# Altium schematic sheet CS301_YOURGROUPNUM.SchDoc: G14 PCB
size A4; SheetNumber: 1; SheetTotal: 1
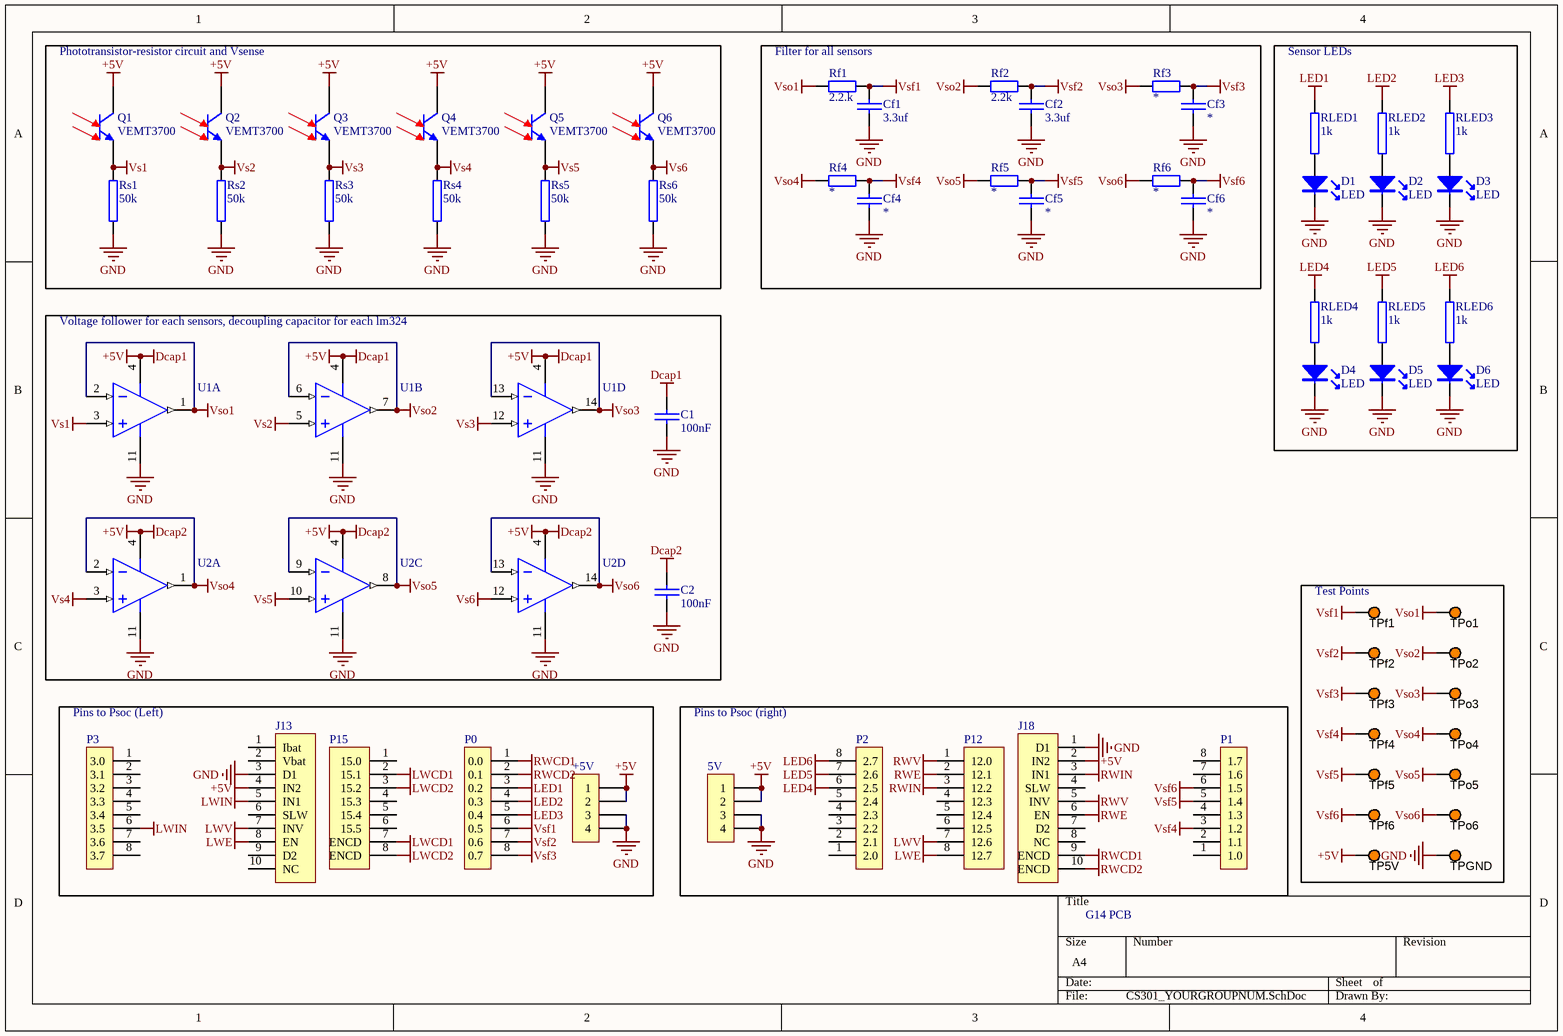
[diagram p0: CS301_YOURGROUPNUM.SchDoc]

## Parts
5V  5V  [IDC4]  (value not drawn)
+5V  5V  [IDC4]  (value not drawn)
C1  100nF  [CCAP-5P0]
C2  100nF  [CCAP-5P0]
Cf1  3.3uf  [CCAP-5P0]
Cf2  3.3uf  [CCAP-5P0]
Cf3  *  [CCAP-5P0]
Cf4  *  [CCAP-5P0]
Cf5  *  [CCAP-5P0]
Cf6  *  [CCAP-5P0]
D1  LED  [LED0.1/5MM]
D2  LED  [LED0.1/5MM]
D3  LED  [LED0.1/5MM]
D4  LED  [LED0.1/5MM]
D5  LED  [LED0.1/5MM]
D6  LED  [LED0.1/5MM]
J13  CON10  [idc10]  (value not drawn)
J18  CON10  [IDC10]  (value not drawn)
P0  P0  [idc8]  (value not drawn)
P1  P1  [idc8]  (value not drawn)
P2  P2  [idc8]  (value not drawn)
P3  P3  [idc8]  (value not drawn)
P12  P12  [idc8]  (value not drawn)
P15  P15  [idc8]  (value not drawn)
Q1  VEMT3700  [VEMT3700]
Q2  VEMT3700  [VEMT3700]
Q3  VEMT3700  [VEMT3700]
Q4  VEMT3700  [VEMT3700]
Q5  VEMT3700  [VEMT3700]
Q6  VEMT3700  [VEMT3700]
Rf1  2.2.k  [AXIAL-0.4]
Rf2  2.2k  [AXIAL-0.4]
Rf3  *  [AXIAL-0.4]
Rf4  *  [AXIAL-0.4]
Rf5  *  [AXIAL-0.4]
Rf6  *  [AXIAL-0.4]
RLED1  1k  [AXIAL0.4]
RLED2  1k  [AXIAL0.4]
RLED3  1k  [AXIAL0.4]
RLED4  1k  [AXIAL0.4]
RLED5  1k  [AXIAL0.4]
RLED6  1k  [AXIAL0.4]
Rs1  50k  [AXIAL0.4]
Rs2  50k  [AXIAL0.4]
Rs3  50k  [AXIAL0.4]
Rs4  50k  [AXIAL0.4]
Rs5  50k  [AXIAL0.4]
Rs6  50k  [AXIAL0.4]
TP5V  5003  [TP_TH]  (value not drawn)
TPf1  5003  [TP_TH]  (value not drawn)
TPf2  5003  [TP_TH]  (value not drawn)
TPf3  5003  [TP_TH]  (value not drawn)
TPf4  5003  [TP_TH]  (value not drawn)
TPf5  5003  [TP_TH]  (value not drawn)
TPf6  5003  [TP_TH]  (value not drawn)
TPGND  5003  [TP_TH]  (value not drawn)
TPo1  5003  [TP_TH]  (value not drawn)
TPo2  5003  [TP_TH]  (value not drawn)
TPo3  5003  [TP_TH]  (value not drawn)
TPo4  5003  [TP_TH]  (value not drawn)
TPo5  5003  [TP_TH]  (value not drawn)
TPo6  5003  [TP_TH]  (value not drawn)
U1  LM324  [DIP-14]  (value not drawn)  (parts A,B,D of 4)
U2  LM324  [DIP-14]  (value not drawn)  (parts A,C,D of 4)

## Blocks framed on the sheet
Phototransistor-resistor circuit and Vsense: Q1-Q6 Rs1-Rs6
Filter for all sensors: Cf1-Cf6 Rf1-Rf6
Sensor LEDs: D1-D6 RLED1-RLED6
Test Points: TP5V TPf1-TPf6 TPGND TPo1-TPo6
Pins to Psoc (Left): +5V J13 P0 P3 P15
Pins to Psoc (right): 5V J18 P1 P2 P12

## Nets
+5V: 5V.1 5V.2 +5V.1 +5V.2 C1.1 C2.1 J13.4(IN2) J18.2(IN2) Q1.1(C) Q2.1(C) Q3.1(C) Q4.1(C) Q5.1(C) Q6.1(C) TP5V.1 U1.4(VDD) U2.4(VDD)  [also labelled Dcap1, Dcap2]
GND: 5V.3 5V.4 +5V.3 +5V.4 C1.2 C2.2 Cf1.2 Cf2.2 Cf3.2 Cf4.2 Cf5.2 Cf6.2 D1.K D2.K D3.K D4.K D5.K D6.K J13.3(D1) J18.1(D1) Rs1.2 Rs2.2 Rs3.2 Rs4.2 Rs5.2 Rs6.2 TPGND.1 U1.11(VSS) U2.11(VSS)
LED1: P0.3(0.2) RLED1.1
LED2: P0.4(0.3) RLED2.1
LED3: P0.5(0.4) RLED3.1
LED4: P2.6(2.5) RLED4.1
LED5: P2.7(2.6) RLED5.1
LED6: P2.8(2.7) RLED6.1
LWCD1: P15.2(15.1) P15.7(ENCD)
LWCD2: P15.3(15.2) P15.8(ENCD)
LWE: J13.8(EN) P12.8(12.7)
LWIN: J13.5(IN1) P3.6(3.5)
LWV: J13.7(INV) P12.7(12.6)
RWCD1: J18.9(ENCD) P0.1(0.0)
RWCD2: J18.10(ENCD) P0.2(0.1)
RWE: J18.6(EN) P12.2(12.1)
RWIN: J18.3(IN1) P12.3(12.2)
RWV: J18.5(INV) P12.1(12.0)
Vs1: Q1.2(E) Rs1.1 U1.3(VINA+)
Vs2: Q2.2(E) Rs2.1 U1.5(VINB+)
Vs3: Q3.2(E) Rs3.1 U1.12(VIND+)
Vs4: Q4.2(E) Rs4.1 U2.3(VINA+)
Vs5: Q5.2(E) Rs5.1 U2.10(VINC+)
Vs6: Q6.2(E) Rs6.1 U2.12(VIND+)
Vsf1: Cf1.1 P0.6(0.5) Rf1.2 TPf1.1
Vsf2: Cf2.1 P0.7(0.6) Rf2.2 TPf2.1
Vsf3: Cf3.1 P0.8(0.7) Rf3.2 TPf3.1
Vsf4: Cf4.1 P1.3(1.2) Rf4.2 TPf4.1
Vsf5: Cf5.1 P1.5(1.4) Rf5.2 TPf5.1
Vsf6: Cf6.1 P1.6(1.5) Rf6.2 TPf6.1
Vso1: Rf1.1 TPo1.1 U1.1(VOUTA) U1.2(VINA-)
Vso2: Rf2.1 TPo2.1 U1.6(VINB-) U1.7(VOUTB)
Vso3: Rf3.1 TPo3.1 U1.13(VIND-) U1.14(VOUTD)
Vso4: Rf4.1 TPo4.1 U2.1(VOUTA) U2.2(VINA-)
Vso5: Rf5.1 TPo5.1 U2.8(VOUTC) U2.9(VINC-)
Vso6: Rf6.1 TPo6.1 U2.13(VIND-) U2.14(VOUTD)
NetD1_A: D1.A RLED1.2
NetD2_A: D2.A RLED2.2
NetD3_A: D3.A RLED3.2
NetD4_A: D4.A RLED4.2
NetD5_A: D5.A RLED5.2
NetD6_A: D6.A RLED6.2

Not connected (* = marked no-connect by the designer): J13 1(Ibat) 2(Vbat) 6(SLW) 9(D2) 10(NC); J18 4(SLW) 7(D2) 8(NC); P1 1(1.0) 2(1.1) 4(1.3) 7(1.6) 8(1.7); P2 1(2.0) 2(2.1) 3(2.2) 4(2.3) 5(2.4); P3 1(3.0) 2(3.1) 3(3.2) 4(3.3) 5(3.4) 7(3.6) 8(3.7); P12 4(12.3) 5(12.4) 6(12.5); P15 1(15.0) 4(15.3) 5(15.4) 6(15.5)

## Notes on the sheet
- Voltage follower for each sensors, decoupling capacitor for each lm324

## Library data of the parts
5V +5V = CON4: Connector
C1 C2 Cf1-Cf6 = CerCap_TH_5P0: TH ceramic capacitor with 5mm pitch
  C1 C2: Value: 100nF
  Cf1 Cf2: Value: 3.3uf
  Cf3-Cf6: Value: *
J13 J18 = CON10: Connector
P0-P3 = CON8: Connector
P12 P15 = CON8_1: Connector
Q1-Q6 = VEMT3700: Silicon NPN Phototransistor
Rf1-Rf6 = Res_TH_0AX4: Through hole resistor; Published: 8-Jun-2000; LatestRevisionDate: 17-Jul-2002; LatestRevisionNote: Re-released for DXP Platform.; PackageReference: AXIAL-0.4; Publisher: Altium Limited; ComponentLink1Description: http://www.royalohm.com/pdf/product2017/PrecisionMetalMF.pdf
  Rf1: Value: 2.2.k
  Rf2: Value: 2.2k
  Rf3-Rf6: Value: *
RLED1-RLED6 Rs1-Rs6 = RES2
  RLED1-RLED6: Value: 1k
  Rs1-Rs6: Value: 50k
TP5V TPf1-TPf6 TPGND TPo1-TPo6 = TestPoint: Test Point, Orange, 1-Pin THD, RoHS; Peak Reverse Current: 600 uA; Forward Current: 3 A; Max Surge Current: 80 A; Forward Voltage: 1.08 V; Max Operating Temperature: 150 degC; PackageReference: 5003; Pins: 2; ComponentLink2URL: http://keyelco.com/userAssets/file/M65p56.pdf; PackageDescription: 1-Pin Through Hole Device, Dia 2.54 mm; Weight: 0.01 lb; Diameter: 5.3 mm; Mount: Through Hole; Package Quantity: 500; Packaging: Bulk; Min Operating Temperature: -65 degC; ComponentLink1Description: Manufacturer URL; Height: 0.25 inch; ComponentLink1URL: http://www.keyelco.com/; ComponentLink2Description: Datasheet; Width: 0.25 inch; REACH SVHC: No SVHC; RoHSCompliant: true; Radiation Hardening: No; Length: 9.5 mm; DatasheetVersion: Jun-15
U1 U2 = LM324N_TH_DIP16: IC OPAMP GP 14DIP; Manufacturer: ON Semiconductor; Manufacturer Part Number: LM324N; Amplifier Type: General Purpose; Current - Supply: 1mA; Voltage - Supply, Single/Dual (±): 3 V ~ 32 V, ±1.5 V ~ 16 V; Supplier 1: Digi-Key; RoHS: RoHS Compliant; Category: Integrated Circuits (ICs); Stock 1: 2900; Pricing 1: 1=0.9, 10=0.775, 100=0.5789, 500=0.45482, 1000=0.35145 (NZD); Packaging: Tube; Part Status: Active; Output Type: -; Slew Rate: -; Operating Temperature: 0°C ~ 70°C; Mounting Type: Through Hole; Package / Case: 14-DIP (0.300", 7.62mm); Supplier Device Package: 14-DIP; Base Part Number: LM324; ComponentLink1URL: https://www.fairchildsemi.com/datasheets/LM/LM2902.pdf; ComponentLink1Description: https://www.fairchildsemi.com/datasheets/LM/LM2902.pdf; Supplier Part Number 1: LM324NFS-ND